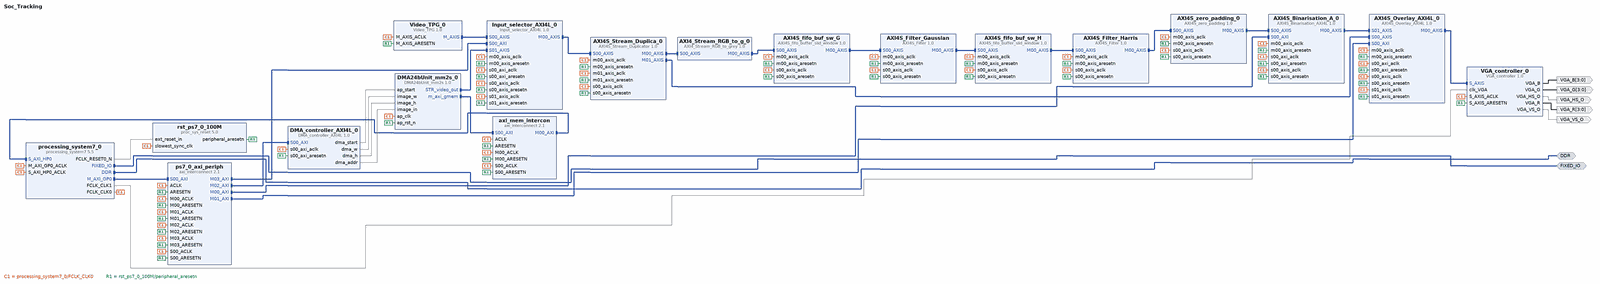
[diagram p0: block diagram of the top level, whole]
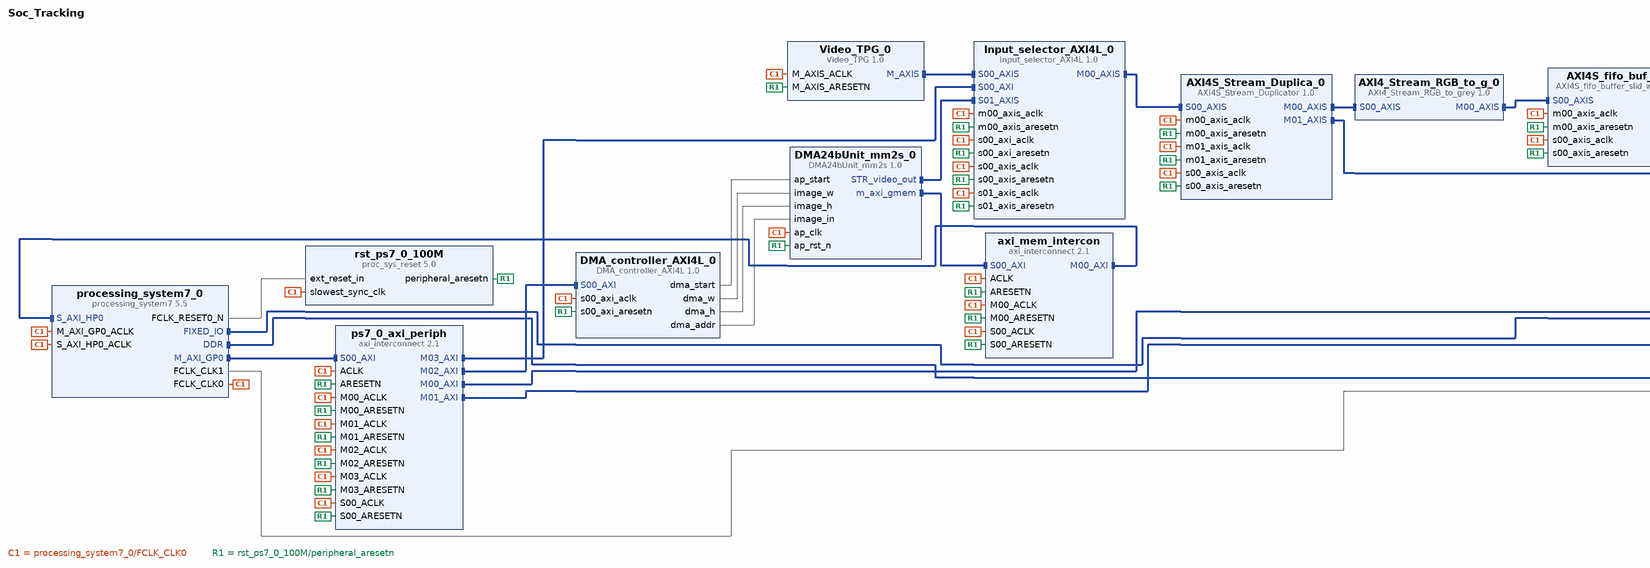
[diagram p1: block diagram of the top level, left part]
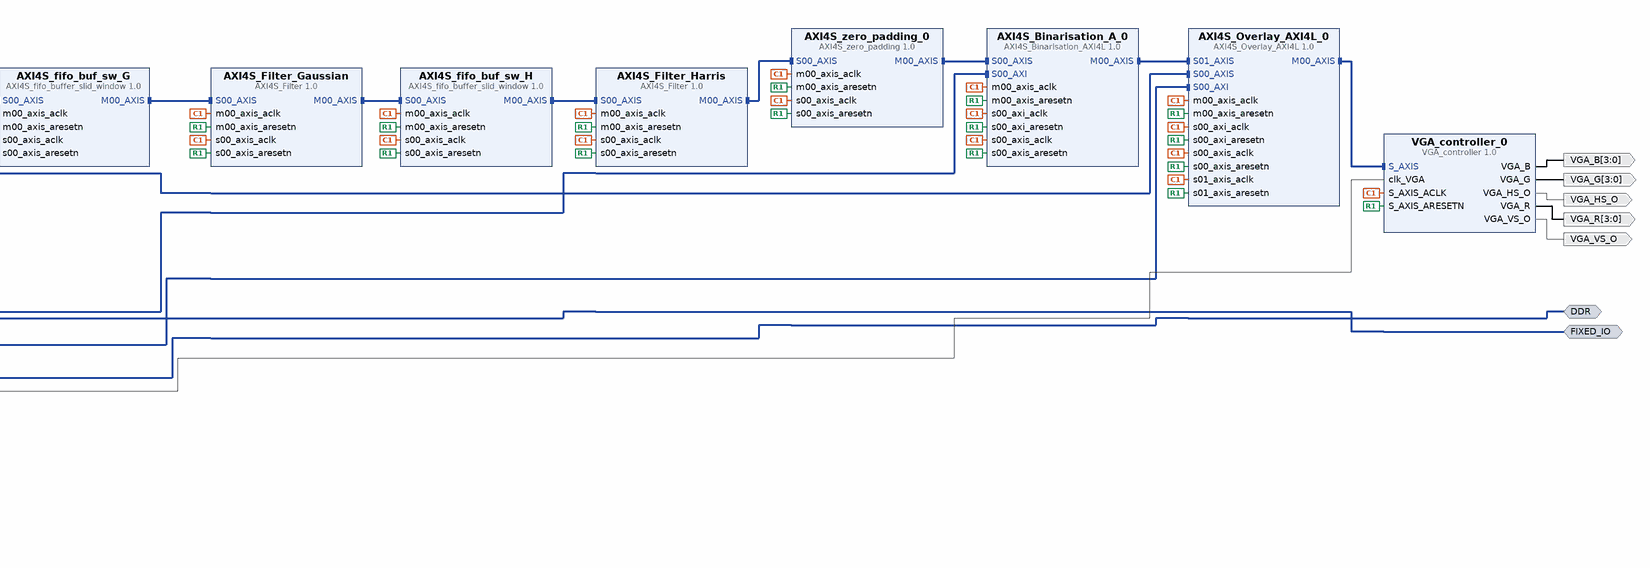
[diagram p2: block diagram of the top level, right part]
# Vivado block design Soc_Tracking, xc7z010clg400-1, Vivado 2020.2
create_bd_design Soc_Tracking

create_bd_intf_port -mode Master -vlnv xilinx.com:interface:ddrx_rtl:1.0 DDR
create_bd_intf_port -mode Master -vlnv xilinx.com:display_processing_system7:fixedio_rtl:1.0 FIXED_IO
create_bd_port -dir O -from 3 -to 0 -type data VGA_G
create_bd_port -dir O -from 3 -to 0 -type data VGA_B
create_bd_port -dir O -from 3 -to 0 -type data VGA_R
create_bd_port -dir O -type data VGA_VS_O
create_bd_port -dir O -type data VGA_HS_O

create_bd_cell -type ip -vlnv xilinx.com:ip:processing_system7:5.5 processing_system7_0
set_property -dict [list \
  CONFIG.PCW_APU_PERIPHERAL_FREQMHZ 650 \
  CONFIG.PCW_CRYSTAL_PERIPHERAL_FREQMHZ 50 \
  CONFIG.PCW_ENET0_ENET0_IO {MIO 16 .. 27} \
  CONFIG.PCW_ENET0_GRP_MDIO_ENABLE 1 \
  CONFIG.PCW_ENET0_GRP_MDIO_IO {MIO 52 .. 53} \
  CONFIG.PCW_ENET0_PERIPHERAL_ENABLE 1 \
  CONFIG.PCW_ENET0_RESET_ENABLE 1 \
  CONFIG.PCW_ENET0_RESET_IO {MIO 9} \
  CONFIG.PCW_ENET_RESET_ENABLE 1 \
  CONFIG.PCW_ENET_RESET_SELECT {Share reset pin} \
  CONFIG.PCW_EN_CLK1_PORT 1 \
  CONFIG.PCW_FCLK_CLK1_BUF TRUE \
  CONFIG.PCW_FPGA0_PERIPHERAL_FREQMHZ 100 \
  CONFIG.PCW_FPGA1_PERIPHERAL_FREQMHZ 25 \
  CONFIG.PCW_FPGA_FCLK1_ENABLE 1 \
  CONFIG.PCW_GPIO_MIO_GPIO_ENABLE 1 \
  CONFIG.PCW_GPIO_MIO_GPIO_IO MIO \
  CONFIG.PCW_I2C_RESET_ENABLE 1 \
  CONFIG.PCW_PRESET_BANK1_VOLTAGE {LVCMOS 1.8V} \
  CONFIG.PCW_QSPI_PERIPHERAL_ENABLE 0 \
  CONFIG.PCW_SD0_GRP_CD_ENABLE 1 \
  CONFIG.PCW_SD0_GRP_CD_IO {MIO 47} \
  CONFIG.PCW_SD0_GRP_WP_ENABLE 0 \
  CONFIG.PCW_SD0_PERIPHERAL_ENABLE 1 \
  CONFIG.PCW_SD0_SD0_IO {MIO 40 .. 45} \
  CONFIG.PCW_SDIO_PERIPHERAL_FREQMHZ 100 \
  CONFIG.PCW_UART0_PERIPHERAL_ENABLE 1 \
  CONFIG.PCW_UART0_UART0_IO {MIO 14 .. 15} \
  CONFIG.PCW_UART_PERIPHERAL_FREQMHZ 100 \
  CONFIG.PCW_UIPARAM_DDR_BUS_WIDTH {16 Bit} \
  CONFIG.PCW_UIPARAM_DDR_FREQ_MHZ 525 \
  CONFIG.PCW_UIPARAM_DDR_PARTNO {MT41K256M16 RE-125} \
  CONFIG.PCW_USB0_PERIPHERAL_ENABLE 1 \
  CONFIG.PCW_USB0_RESET_ENABLE 1 \
  CONFIG.PCW_USB0_RESET_IO {MIO 46} \
  CONFIG.PCW_USB0_USB0_IO {MIO 28 .. 39} \
  CONFIG.PCW_USB_RESET_ENABLE 1 \
  CONFIG.PCW_USB_RESET_SELECT {Share reset pin} \
  CONFIG.PCW_USE_S_AXI_HP0 1 \
] [get_bd_cells processing_system7_0]
# 295 more settings of processing_system7_0 are not shown: defaults, MIO pin electricals, DDR timing, and values the tool derives
create_bd_cell -type ip -vlnv xilinx.com:ip:proc_sys_reset:5.0 rst_ps7_0_100M
create_bd_cell -type ip -vlnv xilinx.com:hls:DMA24bUnit_mm2s:1.0 DMA24bUnit_mm2s_0
create_bd_cell -type ip -vlnv xilinx.com:user:AXI4S_zero_padding:1.0 AXI4S_zero_padding_0
set_property -dict [list \
  CONFIG.C_COLUMN_AFTER 2 \
  CONFIG.C_COLUMN_BEFORE 2 \
  CONFIG.C_IMAGE_IN_HEIGHT 476 \
  CONFIG.C_IMAGE_IN_WIDTH 636 \
  CONFIG.C_LINE_AFTER 2 \
  CONFIG.C_LINE_BEFORE 2 \
] [get_bd_cells AXI4S_zero_padding_0]
create_bd_cell -type ip -vlnv xilinx.com:user:AXI4S_Filter:1.0 AXI4S_Filter_Gaussian
create_bd_cell -type ip -vlnv xilinx.com:user:AXI4S_Filter:1.0 AXI4S_Filter_Harris
set_property -dict [list \
  CONFIG.C_FILTER_DIVISER 1 \
  CONFIG.C_FILTER_PARAM_1_1 0 \
  CONFIG.C_FILTER_PARAM_1_2 -1 \
  CONFIG.C_FILTER_PARAM_1_3 0 \
  CONFIG.C_FILTER_PARAM_2_1 -1 \
  CONFIG.C_FILTER_PARAM_2_3 -1 \
  CONFIG.C_FILTER_PARAM_3_1 0 \
  CONFIG.C_FILTER_PARAM_3_2 -1 \
  CONFIG.C_FILTER_PARAM_3_3 0 \
  CONFIG.C_IMAGE_HEIGHT 476 \
  CONFIG.C_IMAGE_WIDTH 636 \
] [get_bd_cells AXI4S_Filter_Harris]
create_bd_cell -type ip -vlnv xilinx.com:user:AXI4_Stream_RGB_to_grey:1.0 AXI4_Stream_RGB_to_g_0
create_bd_cell -type ip -vlnv xilinx.com:user:VGA_controller:1.0 VGA_controller_0
create_bd_cell -type ip -vlnv xilinx.com:user:Video_TPG:1.0 Video_TPG_0
create_bd_cell -type ip -vlnv xilinx.com:user:DMA_controller_AXI4L:1.0 DMA_controller_AXI4L_0
create_bd_cell -type ip -vlnv xilinx.com:user:Input_selector_AXI4L:1.0 Input_selector_AXI4L_0
create_bd_cell -type ip -vlnv xilinx.com:user:AXI4S_Stream_Duplicator:1.0 AXI4S_Stream_Duplica_0
create_bd_cell -type ip -vlnv xilinx.com:ip:axi_interconnect:2.1 ps7_0_axi_periph
set_property -dict {CONFIG.NUM_MI 4} [get_bd_cells ps7_0_axi_periph]
create_bd_cell -type ip -vlnv xilinx.com:ip:axi_interconnect:2.1 axi_mem_intercon
set_property -dict {CONFIG.NUM_MI 1} [get_bd_cells axi_mem_intercon]
create_bd_cell -type ip -vlnv xilinx.com:user:AXI4S_Overlay_AXI4L:1.0 AXI4S_Overlay_AXI4L_0
create_bd_cell -type ip -vlnv xilinx.com:user:AXI4S_fifo_buffer_slid_window:1.0 AXI4S_fifo_buf_sw_G
create_bd_cell -type ip -vlnv xilinx.com:user:AXI4S_fifo_buffer_slid_window:1.0 AXI4S_fifo_buf_sw_H
set_property -dict {CONFIG.C_IMAGE_IN_HEIGHT 478 CONFIG.C_IMAGE_IN_WIDTH 638} [get_bd_cells AXI4S_fifo_buf_sw_H]
create_bd_cell -type ip -vlnv xilinx.com:user:AXI4S_Binarisation_AXI4L:1.0 AXI4S_Binarisation_A_0

# ---- connections ----

connect_bd_intf_net [get_bd_intf_pins ps7_0_axi_periph/M00_AXI] [get_bd_intf_pins AXI4S_Binarisation_A_0/S00_AXI]
connect_bd_intf_net [get_bd_intf_pins axi_mem_intercon/M00_AXI] [get_bd_intf_pins processing_system7_0/S_AXI_HP0]
connect_bd_intf_net [get_bd_intf_ports FIXED_IO] [get_bd_intf_pins processing_system7_0/FIXED_IO]
connect_bd_intf_net [get_bd_intf_pins AXI4S_Filter_Gaussian/M00_AXIS] [get_bd_intf_pins AXI4S_fifo_buf_sw_H/S00_AXIS]
connect_bd_intf_net [get_bd_intf_pins Input_selector_AXI4L_0/M00_AXIS] [get_bd_intf_pins AXI4S_Stream_Duplica_0/S00_AXIS]
connect_bd_intf_net -intf_net AXI4S_fifo_buffer_sl_0_M00_AXIS [get_bd_intf_pins AXI4S_fifo_buf_sw_G/M00_AXIS] [get_bd_intf_pins AXI4S_Filter_Gaussian/S00_AXIS]
connect_bd_intf_net [get_bd_intf_pins AXI4S_Binarisation_A_0/M00_AXIS] [get_bd_intf_pins AXI4S_Overlay_AXI4L_0/S01_AXIS]
connect_bd_intf_net [get_bd_intf_pins AXI4S_Stream_Duplica_0/M01_AXIS] [get_bd_intf_pins AXI4S_Overlay_AXI4L_0/S00_AXIS]
connect_bd_intf_net [get_bd_intf_pins DMA24bUnit_mm2s_0/STR_video_out] [get_bd_intf_pins Input_selector_AXI4L_0/S01_AXIS]
connect_bd_intf_net [get_bd_intf_pins processing_system7_0/M_AXI_GP0] [get_bd_intf_pins ps7_0_axi_periph/S00_AXI]
connect_bd_intf_net [get_bd_intf_pins DMA24bUnit_mm2s_0/m_axi_gmem] [get_bd_intf_pins axi_mem_intercon/S00_AXI]
connect_bd_intf_net [get_bd_intf_pins AXI4S_Filter_Harris/M00_AXIS] [get_bd_intf_pins AXI4S_zero_padding_0/S00_AXIS]
connect_bd_intf_net [get_bd_intf_pins ps7_0_axi_periph/M03_AXI] [get_bd_intf_pins Input_selector_AXI4L_0/S00_AXI]
connect_bd_intf_net [get_bd_intf_pins AXI4S_fifo_buf_sw_G/S00_AXIS] [get_bd_intf_pins AXI4_Stream_RGB_to_g_0/M00_AXIS]
connect_bd_intf_net [get_bd_intf_pins AXI4S_zero_padding_0/M00_AXIS] [get_bd_intf_pins AXI4S_Binarisation_A_0/S00_AXIS]
connect_bd_intf_net [get_bd_intf_pins AXI4S_Overlay_AXI4L_0/M00_AXIS] [get_bd_intf_pins VGA_controller_0/S_AXIS]
connect_bd_intf_net [get_bd_intf_pins Video_TPG_0/M_AXIS] [get_bd_intf_pins Input_selector_AXI4L_0/S00_AXIS]
connect_bd_intf_net [get_bd_intf_pins ps7_0_axi_periph/M01_AXI] [get_bd_intf_pins AXI4S_Overlay_AXI4L_0/S00_AXI]
connect_bd_intf_net [get_bd_intf_pins AXI4S_Stream_Duplica_0/M00_AXIS] [get_bd_intf_pins AXI4_Stream_RGB_to_g_0/S00_AXIS]
connect_bd_intf_net [get_bd_intf_pins ps7_0_axi_periph/M02_AXI] [get_bd_intf_pins DMA_controller_AXI4L_0/S00_AXI]
connect_bd_intf_net -intf_net AXI4S_fifo_buffer_sl_1_M00_AXIS [get_bd_intf_pins AXI4S_fifo_buf_sw_H/M00_AXIS] [get_bd_intf_pins AXI4S_Filter_Harris/S00_AXIS]
connect_bd_intf_net [get_bd_intf_ports DDR] [get_bd_intf_pins processing_system7_0/DDR]
connect_bd_net [get_bd_pins processing_system7_0/FCLK_CLK0] \
  [get_bd_pins processing_system7_0/M_AXI_GP0_ACLK] [get_bd_pins rst_ps7_0_100M/slowest_sync_clk] \
  [get_bd_pins processing_system7_0/S_AXI_HP0_ACLK] [get_bd_pins DMA24bUnit_mm2s_0/ap_clk] \
  [get_bd_pins AXI4S_zero_padding_0/m00_axis_aclk] [get_bd_pins AXI4S_zero_padding_0/s00_axis_aclk] \
  [get_bd_pins AXI4S_Filter_Gaussian/s00_axis_aclk] [get_bd_pins AXI4S_Filter_Gaussian/m00_axis_aclk] \
  [get_bd_pins AXI4S_Filter_Harris/s00_axis_aclk] [get_bd_pins AXI4S_Filter_Harris/m00_axis_aclk] \
  [get_bd_pins VGA_controller_0/S_AXIS_ACLK] [get_bd_pins AXI4S_Stream_Duplica_0/m01_axis_aclk] \
  [get_bd_pins AXI4S_Stream_Duplica_0/m00_axis_aclk] [get_bd_pins AXI4S_Stream_Duplica_0/s00_axis_aclk] \
  [get_bd_pins Input_selector_AXI4L_0/m00_axis_aclk] [get_bd_pins DMA_controller_AXI4L_0/s00_axi_aclk] \
  [get_bd_pins Input_selector_AXI4L_0/s00_axi_aclk] [get_bd_pins Input_selector_AXI4L_0/s00_axis_aclk] \
  [get_bd_pins Video_TPG_0/M_AXIS_ACLK] [get_bd_pins Input_selector_AXI4L_0/s01_axis_aclk] \
  [get_bd_pins ps7_0_axi_periph/ACLK] [get_bd_pins ps7_0_axi_periph/S00_ACLK] [get_bd_pins ps7_0_axi_periph/M00_ACLK] \
  [get_bd_pins ps7_0_axi_periph/M01_ACLK] [get_bd_pins ps7_0_axi_periph/M02_ACLK] [get_bd_pins ps7_0_axi_periph/M03_ACLK] \
  [get_bd_pins axi_mem_intercon/ACLK] [get_bd_pins axi_mem_intercon/S00_ACLK] [get_bd_pins axi_mem_intercon/M00_ACLK] \
  [get_bd_pins AXI4S_Overlay_AXI4L_0/s00_axis_aclk] [get_bd_pins AXI4S_Overlay_AXI4L_0/s01_axis_aclk] \
  [get_bd_pins AXI4S_Overlay_AXI4L_0/m00_axis_aclk] [get_bd_pins AXI4S_Overlay_AXI4L_0/s00_axi_aclk] \
  [get_bd_pins AXI4S_fifo_buf_sw_G/s00_axis_aclk] [get_bd_pins AXI4S_fifo_buf_sw_G/m00_axis_aclk] \
  [get_bd_pins AXI4S_fifo_buf_sw_H/s00_axis_aclk] [get_bd_pins AXI4S_fifo_buf_sw_H/m00_axis_aclk] \
  [get_bd_pins AXI4S_Binarisation_A_0/s00_axi_aclk] [get_bd_pins AXI4S_Binarisation_A_0/s00_axis_aclk] \
  [get_bd_pins AXI4S_Binarisation_A_0/m00_axis_aclk]
connect_bd_net [get_bd_pins processing_system7_0/FCLK_RESET0_N] [get_bd_pins rst_ps7_0_100M/ext_reset_in]
connect_bd_net [get_bd_pins rst_ps7_0_100M/peripheral_aresetn] \
  [get_bd_pins AXI4S_zero_padding_0/m00_axis_aresetn] [get_bd_pins AXI4S_zero_padding_0/s00_axis_aresetn] \
  [get_bd_pins AXI4S_Filter_Gaussian/s00_axis_aresetn] [get_bd_pins AXI4S_Filter_Gaussian/m00_axis_aresetn] \
  [get_bd_pins AXI4S_Filter_Harris/s00_axis_aresetn] [get_bd_pins AXI4S_Filter_Harris/m00_axis_aresetn] \
  [get_bd_pins VGA_controller_0/S_AXIS_ARESETN] [get_bd_pins AXI4S_Stream_Duplica_0/m01_axis_aresetn] \
  [get_bd_pins AXI4S_Stream_Duplica_0/m00_axis_aresetn] [get_bd_pins AXI4S_Stream_Duplica_0/s00_axis_aresetn] \
  [get_bd_pins Input_selector_AXI4L_0/m00_axis_aresetn] [get_bd_pins DMA_controller_AXI4L_0/s00_axi_aresetn] \
  [get_bd_pins Input_selector_AXI4L_0/s00_axi_aresetn] [get_bd_pins Input_selector_AXI4L_0/s00_axis_aresetn] \
  [get_bd_pins Video_TPG_0/M_AXIS_ARESETN] [get_bd_pins Input_selector_AXI4L_0/s01_axis_aresetn] \
  [get_bd_pins ps7_0_axi_periph/S00_ARESETN] [get_bd_pins ps7_0_axi_periph/M00_ARESETN] \
  [get_bd_pins ps7_0_axi_periph/ARESETN] [get_bd_pins ps7_0_axi_periph/M01_ARESETN] \
  [get_bd_pins ps7_0_axi_periph/M02_ARESETN] [get_bd_pins ps7_0_axi_periph/M03_ARESETN] \
  [get_bd_pins DMA24bUnit_mm2s_0/ap_rst_n] [get_bd_pins axi_mem_intercon/S00_ARESETN] \
  [get_bd_pins axi_mem_intercon/M00_ARESETN] [get_bd_pins axi_mem_intercon/ARESETN] \
  [get_bd_pins AXI4S_Overlay_AXI4L_0/s00_axis_aresetn] [get_bd_pins AXI4S_Overlay_AXI4L_0/s01_axis_aresetn] \
  [get_bd_pins AXI4S_Overlay_AXI4L_0/m00_axis_aresetn] [get_bd_pins AXI4S_Overlay_AXI4L_0/s00_axi_aresetn] \
  [get_bd_pins AXI4S_fifo_buf_sw_G/s00_axis_aresetn] [get_bd_pins AXI4S_fifo_buf_sw_G/m00_axis_aresetn] \
  [get_bd_pins AXI4S_fifo_buf_sw_H/s00_axis_aresetn] [get_bd_pins AXI4S_fifo_buf_sw_H/m00_axis_aresetn] \
  [get_bd_pins AXI4S_Binarisation_A_0/s00_axi_aresetn] [get_bd_pins AXI4S_Binarisation_A_0/s00_axis_aresetn] \
  [get_bd_pins AXI4S_Binarisation_A_0/m00_axis_aresetn]
connect_bd_net [get_bd_pins processing_system7_0/FCLK_CLK1] [get_bd_pins VGA_controller_0/clk_VGA]
connect_bd_net [get_bd_pins VGA_controller_0/VGA_G] [get_bd_ports VGA_G]
connect_bd_net [get_bd_pins VGA_controller_0/VGA_B] [get_bd_ports VGA_B]
connect_bd_net [get_bd_pins VGA_controller_0/VGA_R] [get_bd_ports VGA_R]
connect_bd_net [get_bd_pins VGA_controller_0/VGA_VS_O] [get_bd_ports VGA_VS_O]
connect_bd_net [get_bd_pins VGA_controller_0/VGA_HS_O] [get_bd_ports VGA_HS_O]
connect_bd_net [get_bd_pins DMA_controller_AXI4L_0/dma_start] [get_bd_pins DMA24bUnit_mm2s_0/ap_start]
connect_bd_net [get_bd_pins DMA_controller_AXI4L_0/dma_w] [get_bd_pins DMA24bUnit_mm2s_0/image_w]
connect_bd_net [get_bd_pins DMA_controller_AXI4L_0/dma_h] [get_bd_pins DMA24bUnit_mm2s_0/image_h]
connect_bd_net [get_bd_pins DMA_controller_AXI4L_0/dma_addr] [get_bd_pins DMA24bUnit_mm2s_0/image_in]

# ---- address map ----
assign_bd_address -offset 0x0000000000000000 -range 512M -target_address_space [get_bd_addr_spaces DMA24bUnit_mm2s_0/Data_m_axi_gmem] [get_bd_addr_segs processing_system7_0/S_AXI_HP0/HP0_DDR_LOWOCM]
exclude_bd_addr_seg -offset 0x0000000044A00000 -range 64K -target_address_space [get_bd_addr_spaces DMA24bUnit_mm2s_0/Data_m_axi_gmem] [get_bd_addr_segs AXI4S_Binarisation_A_0/S00_AXI/S00_AXI_reg]
exclude_bd_addr_seg -offset 0x0000000044A20000 -range 64K -target_address_space [get_bd_addr_spaces DMA24bUnit_mm2s_0/Data_m_axi_gmem] [get_bd_addr_segs DMA_controller_AXI4L_0/S00_AXI/S00_AXI_reg]
exclude_bd_addr_seg -offset 0x0000000044A30000 -range 64K -target_address_space [get_bd_addr_spaces DMA24bUnit_mm2s_0/Data_m_axi_gmem] [get_bd_addr_segs Input_selector_AXI4L_0/S00_AXI/S00_AXI_reg]
assign_bd_address -offset 0x44A00000 -range 64K -target_address_space [get_bd_addr_spaces processing_system7_0/Data] [get_bd_addr_segs DMA_controller_AXI4L_0/S00_AXI/S00_AXI_reg]
assign_bd_address -offset 0x44A10000 -range 64K -target_address_space [get_bd_addr_spaces processing_system7_0/Data] [get_bd_addr_segs Input_selector_AXI4L_0/S00_AXI/S00_AXI_reg]
assign_bd_address -offset 0x44A20000 -range 64K -target_address_space [get_bd_addr_spaces processing_system7_0/Data] [get_bd_addr_segs AXI4S_Binarisation_A_0/S00_AXI/S00_AXI_reg]
assign_bd_address -offset 0x44A30000 -range 64K -target_address_space [get_bd_addr_spaces processing_system7_0/Data] [get_bd_addr_segs AXI4S_Overlay_AXI4L_0/S00_AXI/S00_AXI_reg]

validate_bd_design
save_bd_design
